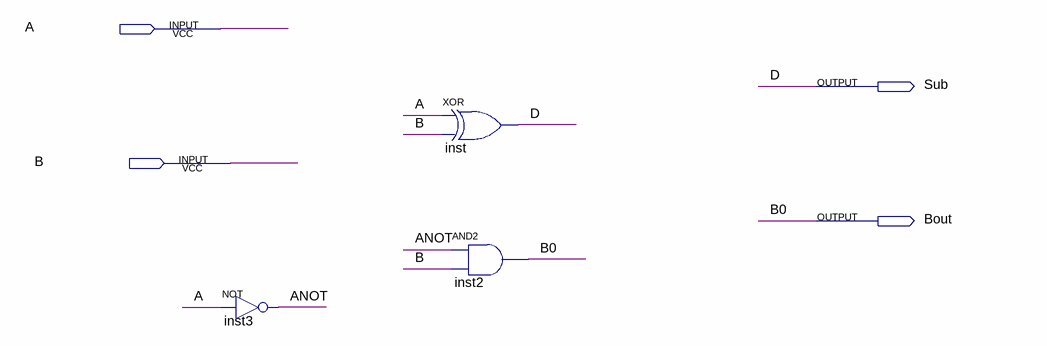
[diagram p0: schematic sheet]
// Quartus schematic HS.bdf as structural Verilog: 3 symbols, 4 pins
module HS (
  input  A,
  input  B,
  output Sub,
  output Bout
);

  wire ANOT;

  not inst3 (ANOT, A);
  xor inst (Sub, A, B);
  and inst2 (Bout, ANOT, B);

  // Other names for the same wires on the sheet: B0 = Bout; D = Sub
endmodule
